# Altium project EPS.PrjPcb
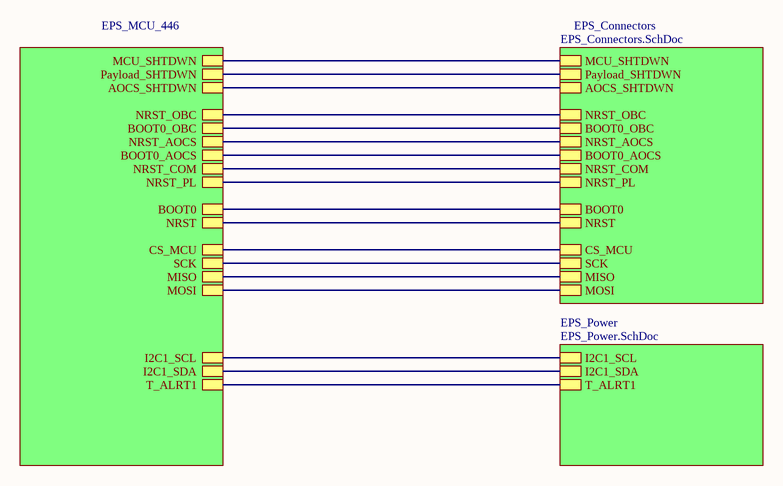
[diagram p0: EPS_Top.SchDoc]
4 sheets, 103 parts. Net scope: hierarchical (ports join the sheet entries above them; power ports are global).
Board file: PCB2EPS.PcbDoc
Sheets:
  EPS_Top.SchDoc
    EPS_Power = EPS_Power.SchDoc
    EPS_Connectors = EPS_Connectors.SchDoc
    EPS_MCU_446 = EPS_MCU.SchDoc

## Sheet EPS_Top.SchDoc
size A4; SheetNumber: 1; SheetTotal: 4

### Sub-sheets
EPS_Connectors = EPS_Connectors.SchDoc: NRST, BOOT0, CS_MCU, SCK, MISO, MOSI, BOOT0_OBC, NRST_OBC, NRST_AOCS, BOOT0_AOCS, NRST_COM, NRST_PL, MCU_SHTDWN, Payload_SHTDWN, AOCS_SHTDWN
EPS_MCU_446 = EPS_MCU.SchDoc: NRST, BOOT0, I2C1_SCL, I2C1_SDA, T_ALRT1, CS_MCU, SCK, MISO, MOSI, BOOT0_OBC, NRST_OBC, NRST_AOCS, BOOT0_AOCS, NRST_COM, NRST_PL, MCU_SHTDWN, Payload_SHTDWN, AOCS_SHTDWN
EPS_Power = EPS_Power.SchDoc: I2C1_SCL, I2C1_SDA, T_ALRT1

### Nets
ALERT: sheet EPS_Power/T_ALRT1, sheet EPS_MCU_446/T_ALRT1
AOCS_SHTDWN: sheet EPS_Connectors/AOCS_SHTDWN, sheet EPS_MCU_446/AOCS_SHTDWN
BOOT0: sheet EPS_Connectors/BOOT0, sheet EPS_MCU_446/BOOT0
BOOT0_AOCS: sheet EPS_Connectors/BOOT0_AOCS, sheet EPS_MCU_446/BOOT0_AOCS
BOOT0_OBC: sheet EPS_Connectors/BOOT0_OBC, sheet EPS_MCU_446/BOOT0_OBC
CS_MCU: sheet EPS_Connectors/CS_MCU, sheet EPS_MCU_446/CS_MCU
MCU_SHTDWN: sheet EPS_Connectors/MCU_SHTDWN, sheet EPS_MCU_446/MCU_SHTDWN
MISO: sheet EPS_Connectors/MISO, sheet EPS_MCU_446/MISO
MOSI: sheet EPS_Connectors/MOSI, sheet EPS_MCU_446/MOSI
NRST: sheet EPS_Connectors/NRST, sheet EPS_MCU_446/NRST
NRST_AOCS: sheet EPS_Connectors/NRST_AOCS, sheet EPS_MCU_446/NRST_AOCS
NRST_COM: sheet EPS_Connectors/NRST_COM, sheet EPS_MCU_446/NRST_COM
NRST_OBC: sheet EPS_Connectors/NRST_OBC, sheet EPS_MCU_446/NRST_OBC
NRST_PL: sheet EPS_Connectors/NRST_PL, sheet EPS_MCU_446/NRST_PL
Payload_SHTDWN: sheet EPS_Connectors/Payload_SHTDWN, sheet EPS_MCU_446/Payload_SHTDWN
SCK: sheet EPS_Connectors/SCK, sheet EPS_MCU_446/SCK
SCL: sheet EPS_Power/I2C1_SCL, sheet EPS_MCU_446/I2C1_SCL
SDA: sheet EPS_Power/I2C1_SDA, sheet EPS_MCU_446/I2C1_SDA

## Sheet EPS_Power.SchDoc
size A4; SheetNumber: 3; SheetTotal: 4
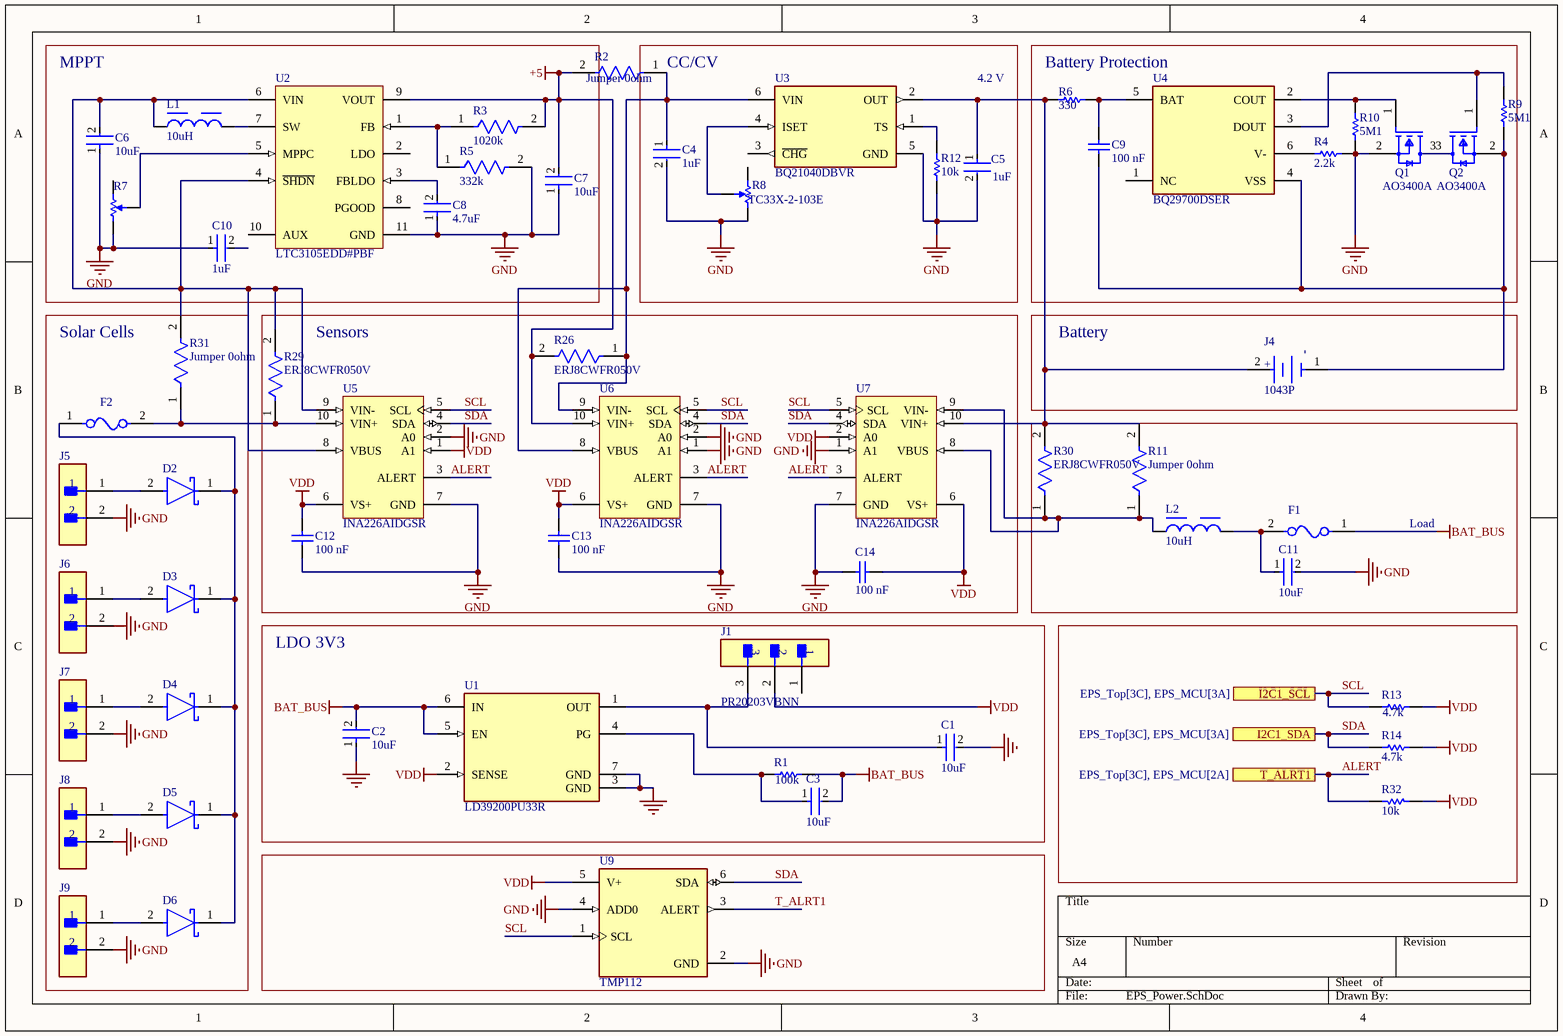
[diagram p1: EPS_Power.SchDoc]

### Parts
C1  10uF  [FP-CL21B106KOQNNNG-MFG]
C2  10uF  [FP-CL21B106KOQNNNG-MFG]
C3  10uF  [FP-CL21B106KOQNNNG-MFG]
C4  1uF  [FP-CL10-IPC_C]
C5  1uF  [FP-CL10-IPC_C]
C6  10uF  [FP-CL21B106KOQNNNG-MFG]
C7  10uF  [FP-CL21B106KOQNNNG-MFG]
C8  4.7uF  [FP-CC0805-0_85-MFG]
C9  100 nF  [CAPC1050X55X23ML05T13]
C10  1uF  [FP-CL10-IPC_A]
C11  10uF  [FP-CL21B106KOQNNNG-MFG]
C12  100 nF  [CAPC1050X55X23ML05T13]
C13  100 nF  [CAPC1050X55X23ML05T13]
C14  100 nF  [CAPC1050X55X23ML05T13]
D2  BAT60AE6327HTSA1  [FP-PG-SOD323-2-IPC_C]  (value not drawn)
D3  BAT60AE6327HTSA1  [FP-PG-SOD323-2-IPC_C]  (value not drawn)
D4  BAT60AE6327HTSA1  [FP-PG-SOD323-2-IPC_C]  (value not drawn)
D5  BAT60AE6327HTSA1  [FP-PG-SOD323-2-IPC_C]  (value not drawn)
D6  BAT60AE6327HTSA1  [FP-PG-SOD323-2-IPC_C]  (value not drawn)
F1  MF-NSMF020-2  [FP-MF-NSMF020-2-MFG]  (value not drawn)
F2  MF-NSMF020-2  [FP-MF-NSMF020-2-MFG]  (value not drawn)
J1  PR20203VBNN  [FP-PR20203VBNN-MFG]
J4  1043P  [FP-1043P-MFG]
J5  B2B-XH-A(LF)(SN)  [FP-B2B-XH-A_LF_SN-MFG]  (value not drawn)
J6  B2B-XH-A(LF)(SN)  [FP-B2B-XH-A_LF_SN-MFG]  (value not drawn)
J7  B2B-XH-A(LF)(SN)  [FP-B2B-XH-A_LF_SN-MFG]  (value not drawn)
J8  B2B-XH-A(LF)(SN)  [FP-B2B-XH-A_LF_SN-MFG]  (value not drawn)
J9  B2B-XH-A(LF)(SN)  [FP-B2B-XH-A_LF_SN-MFG]  (value not drawn)
L1  10uH  [WE-LHMI_4020]
L2  10uH  [WE-LHMI_4020]
Q1  AO3400A  [FP-SOT23-MFG]
Q2  AO3400A  [FP-SOT23-MFG]
R1  100k  [RESC1005X40X25NL05T10]
R2  Jumper 0ohm  [FP-RC1206-MFG]
R3  1020k  [FP-CRCW0603-e3-IPC_A]
R4  2.2k  [RESC1608X55X25LL10T15]
R5  332k  [FP-CRCW0603-e3-IPC_A]
R6  330  [RESC1608X55X30LL15T15]
R7  TC33X-2-103E  [BOUR-TC33X-2_V]  (value not drawn)
R8  TC33X-2-103E  [BOUR-TC33X-2_V]
R9  5M1  [RESC1609X50X30NL10T20]
R10  5M1  [RESC1609X50X30NL10T20]
R11  Jumper 0ohm  [FP-RC1206-MFG]
R12  10k  [RESC1005X40X25LL05T10]
R13  4.7k  [RESC1005X40X25LL05T05]
R14  4.7k  [RESC1005X40X25LL05T05]
R26  ERJ8CWFR050V  [FP-ERJ8CW-IPC_B]
R29  ERJ8CWFR050V  [FP-ERJ8CW-IPC_B]
R30  ERJ8CWFR050V  [FP-ERJ8CW-IPC_B]
R31  Jumper 0ohm  [FP-RC1206-MFG]
R32  10k  [RESC1005X40X25LL05T05]
U1  LD39200PU33R  [FP-DFN6-7946637-MFG]
U2  LTC3105EDD#PBF  [LT-DD-10_V]
U3  BQ21040DBVR  [FP-DBV0006A-MFG]
U4  BQ29700DSER  [FP-DSE0006A-IPC_B]
U5  INA226AIDGSR  [DGS0010A_L]
U6  INA226AIDGSR  [DGS0010A_L]
U7  INA226AIDGSR  [DGS0010A_L]
U9  TMP112  [FP-DRL0006A-MFG]

### Blocks framed on the sheet
MPPT: C6-C8 C10 L1 R3 R5 R7 U2
CC/CV: C4 C5 R8 R12 U3
Battery Protection: C9 Q1 Q2 R4 R6 R9 R10 U4
Solar Cells: D2-D6 F2 J5-J9 R31
Sensors: C12-C14 R26 R29 U5-U7
Battery: J4
Load: C11 F1 L2 R11 R30
LDO 3V3: C1-C3 J1 R1 U1

### Ports
I2C1_SCL (see EPS_Top[3C], EPS_MCU[3A]), I2C1_SDA (see EPS_Top[3C], EPS_MCU[3A]), T_ALRT1 (see EPS_Top[3C], EPS_MCU[2A])

### Nets
+5: C7.2 R2.2 R3.2 R26.2 U2.9(VOUT) U6.10(VIN+)
BAT_BUS: C2.2 C3.2 F1.1 R1.2 U1.5(EN) U1.6(IN)
GND: C1.2 C2.1 C4.2 C5.2 C6.1 C7.1 C8.1 C10.1 C11.2 C12.1 C13.1 C14.1 J5.2 J6.2 J7.2 J8.2 J9.2 Q1.2(S) R4.2 R5.2 R7.1 R8.3 R10.1 R12.2 U1.3(GND) U1.7(GND) U2.11(GND) U3.5(GND) U5.2(A0) U5.7(GND) U6.1(A1) U6.2(A0) U6.7(GND) U7.1(A1) U7.7(GND) U9.2(GND) U9.4(ADD0)
VDD: C12.2 C13.2 C14.2 J1.2 R13.2 R14.2 R32.1 U1.2(SENSE) U5.1(A1) U5.6(VS+) U6.6(VS+) U7.2(A0) U7.6(VS+) U9.5(V+)
ALERT: R32.2 U5.3(ALERT) U6.3(ALERT) U7.3(ALERT) ; port T_ALRT1
SCL: R13.1 U5.5(SCL) U6.5(SCL) U7.5(SCL) U9.1(SCL) ; port I2C1_SCL
SDA: R14.1 U5.4(SDA) U6.4(SDA) U7.4(SDA) U9.6(SDA) ; port I2C1_SDA
T_ALRT1: U9.3(ALERT)
NetC1_1: C1.1 J1.3 U1.1(OUT)
NetC3_1: C3.1 R1.1 U1.4(PG)
NetC4_1: C4.1 R2.1 R26.1 U3.6(VIN) U6.8(VBUS) U6.9(VIN-)
NetC5_1: C5.1 J4.2(A) R6.2 R11.2 R30.2 U3.2(OUT) U7.10(VIN+)
NetC6_2: C6.2 L1.1 R29.2 R31.2 U2.4(~{SHDN}) U2.6(VIN) U5.8(VBUS) U5.9(VIN-)
NetC8_2: C8.2 U2.3(FBLDO)
NetC9_1: C9.1 R6.1 U4.5(BAT)
NetC9_2: C9.2 J4.1(C) Q2.2(S) R9.1 U4.4(VSS)
NetC11_1: C11.1 F1.2 L2.2
NetD2_1: D2.1(C) D3.1(C) D4.1(C) D5.1(C) D6.1(C) F2.1
NetD2_2: D2.2(A) J5.1
NetD3_2: D3.2(A) J6.1
NetD4_2: D4.2(A) J7.1
NetD5_2: D5.2(A) J8.1
NetD6_2: D6.2(A) J9.1
NetF2_2: F2.2 R29.1 R31.1 U5.10(VIN+)
NetL1_2: L1.2 U2.7(SW)
NetL2_1: L2.1 R11.1 R30.1 U7.8(VBUS) U7.9(VIN-)
NetQ1_1: Q1.1(G) R10.2 U4.2(COUT)
NetQ1_3: Q1.3(D) Q2.3(D)
NetQ2_1: Q2.1(G) R9.2 U4.3(DOUT)
NetR3_1: R3.1 R5.1 U2.1(FB)
NetR4_1: R4.1 U4.6(V-)
NetR7_2: R7.2 U2.5(MPPC)
NetR8_2: R8.2 U3.4(ISET)
NetR12_1: R12.1 U3.1(TS)

Not connected (* = marked no-connect by the designer): C10 2; J1 1; R7 3; R8 1; U2 2(LDO) 8(PGOOD) 10(AUX); U3 3(~{CHG}); U4 1(NC)

### Notes on the sheet
- 4.2 V
- (near J1) +3V3
- (in symbol CMP-19636-000034-1) +

### Library data of the parts
C1-C3 C6 C7 C11 = CMP-13271-000015-1: CAP CER 10UF 16V X7R 0805; Manufacturer Part Number: CL21B106KOQNNNG; Manufacturer: Samsung Electro-Mechanics; Temperature Coefficient: 15%; Tolerance: 10%; Material: Ceramic; ComponentLink2URL: http://product.samsungsem.com/mlcc/CL21B106KOQNNN.do; Package: 0; Voltage Rating: 16V; Value: 10uF; Height: 1.4mm; Temperature Characteristic: X7R; Category: Cap; Lead Free: Yes; RoHS: TRUE; ComponentLink2Description: Datasheet; Octopart: https://octopart.com/cl21b106koqnnng-samsung-19995691; Device Class L1: Passive Components; Temperature Range Low: -55°C; Device Class L3: Ceramic Capacitors; Ipc Land Pattern Name: CAPC200125X125; Digikey Description: CAP CER 10UF 16V X7R 0805; Automotive: No; Capacitance: 10uF; Temperature Range High: +125°C; Device Class L2: Capacitors; Temperature: -55°C to +125°C
C4 C5 = CMP-13271-004127-1: Cap Ceramic 1uF 25V X5R ±10% Pad SMD 0603 +85°C T/R; Height: 0.8mm; Capacitance: 1uF; Depth: 0.8mm; Package Quantity: 1; Mount: Surface Mount; Contact Plating: Tin; Voltage Rating: 25V; Dielectric: X5R; Packaging: Tape and Reel; Material: Ceramic; Case Code (Metric): 1608; Length: 1.6mm; Voltage: 25V; Min Operating Temperature: -55°C; Width: 0.031inch; Tolerance: 10%; Case/Package: 0603; Radiation Hardening: No; Case Code (Imperial): 0603; Thickness: 0.035inch; Lead Free: Lead Free; Max Operating Temperature: 85°C; Voltage Rating (DC): 25V
C8 = CMP-03422-000207-1: CAP CER 4.7UF 16V X7R 0805; Manufacturer: Yageo; Manufacturer Part Number: CC0805KKX7R7BB475; Tolerance: 0.1; Material: Ceramic; Footprint Url: http://www.yageo.com/exep/pages/download/literatures/UPY-C_GEN_24.pdf; Device Class L3: Ceramic Capacitors; Temperature: -30°C to +85°C; Device Class L2: Capacitors; Automotive: No; Digikey Description: CAP CER 4.7UF 16V X7R 0805; Temperature Range High: +85°C; Lead Free: Yes; Mouser Description: Multilayer Ceramic Capacitors MLCC - SMD/SMT 4.7M pF 10% 16 Volts; Temperature Characteristic: X7R; Height: 0.95mm; Device Class L1: Passive Components; ComponentLink2Description: Datasheet; Category: Cap; Octopart: https://octopart.com/cc0805kkx7r7bb475-yageo-34429188; Temperature Range Low: -30°C; Package: CC0805-0.85; Ipc Land Pattern Name: CAPC200125X85; RoHS: TRUE; Value: 4.7 uF; Capacitance: 4.7 uF; ComponentLink2URL: http://www.yageo.com/documents/recent/UPY-GPHC_Y5V_6.3V-to-50V_8.pdf; Voltage Rating: 16 V
C9 C12-C14 = CMP-2000-05439-1: Chip Capacitor, 100 nF, +/- 10%, 16 V, -55 to 125 degC, 0402 (1005 Metric), RoHS, Tape and Reel; Manufacturer: Samsung Electro-Mechanics; Capacitance: 100000pF; Dielectric: X7R; Rated Voltage: 16V; Case Size/Dimension: 0402; Tolerance (%): ±10%; Manufacturer URL: http://www.samsungsem.com/global/index.jsp; Datasheet URL: https://datasheet.ciiva.com/29198/458718-da-01-en-vs-kondensator-0402-29198423.pdf; Datasheet Version: Nov-10
C10 = CMP-13271-001457-1: Cap Ceramic 1uF 16V X5R ±10% Pad SMD 0603 +85°C T/R; Dielectric: X5R; Height: 0.8mm; Capacitance: 1uF; Mount: Surface Mount; Thickness: 0.035inch; Width: 0.031inch; Min Operating Temperature: -55°C; Contact Plating: Tin; Case Code (Imperial): 0603; Depth: 0.8mm; Length: 1.6mm; Max Operating Temperature: 85°C; Packaging: Tape and Reel; Tolerance: 10%; Radiation Hardening: No; Case/Package: 0603; Package Quantity: 1; Voltage Rating: 16V; Case Code (Metric): 1608; Voltage: 16V; Material: Ceramic; Lead Free: Lead Free; Voltage Rating (DC): 16V
D2-D6 = CMP-32890-000004-1: DIODE SCHOTTKY 10V 3A SOD323-2; Forward Voltage: 370mV; Polarity: Standard; Peak Non-Repetitive Surge Current: 5A; Element Configuration: Single; Max Operating Temperature: 85°C; Current Rating: 3A; Number of Pins: 2; Mount: Surface Mount; Forward Current: 3A; Max Reverse Voltage (DC): 10V; Output Current: 3A; Contact Plating: Tin; Average Rectified Current: 3A; Lead Free: Lead Free; Max Repetitive Reverse Voltage (Vrrm): 10V; Voltage Rating (DC): 10V; Radiation Hardening: No; Halogen Free: Not Halogen Free; Case/Package: SOD-323-2; REACH SVHC: No SVHC; Min Operating Temperature: -55°C; Packaging: Tape and Reel
F1 F2 = CMP-07400-000029-1: PTC RESET FUSE 24V 200MA 1206; Manufacturer: Bourns; Trip Current: 0.46A; Trip Time: 0.6s; Hold Current: 0.2A; Current Rating: 10A; Resistance: 0.6-2.6Ω; Automotive Grade: Grade 3; Value: 0.6-2.6Ω; Voltage Rating: 24V; Ambient Temperature Range Low: -40°C; Device Class L1: Circuit Protection; Temperature Range Low: -40°C; Temperature: -40°C to +85°C; Category: Fuse; Temperature Range High: +85°C; Mouser Description: Resettable Fuses - PPTC 0.20A 24V 0.60ohm MAX (R); Device Class L3: unset; RoHS: TRUE; Package: MF-NSMF020-2; Ambient Temperature Range High: +85°C; ComponentLink2Description: Datasheet; Digikey Description: PTC RESET FUSE 24V 200MA 1206; Device Class L2: PTC Resettable Fuses; Manufacturer Part Number: MF-NSMF020-2; Octopart: https://octopart.com/mf-nsmf020-2-bourns-94649; Automotive: Yes; Height: 0.85mm; Lead Free: Yes; ComponentLink2URL: https://www.bourns.com/docs/Product-Datasheets/mfnsmf.pdf
J1 = CMP-77940-000002-1: CONN HEADER VERT 3POS 2.54MM; Manufacturer: Metz Connect; Conn Orientation: Straight; Current Rating: 3A; Number Of Contacts: 3; Conn Gender: Male; Temperature: -40°C to +105°C; Pitch: 2.54mm; Device Class L1: Connectors; Digikey Description: CONN HEADER VERT 3POS 2.54MM; ComponentLink2URL: https://datasheet.octopart.com/PR20203VBNN-Metz-Connect-datasheet-101610322.pdf; Height: 8.6mm; Temperature Range High: +105°C; Manufacturer Part Number: PR20203VBNN; Number Of Rows: 1; Octopart: https://octopart.com/pr20203vbnn-metz+connect-87667116; Device Class L3: unset; ComponentLink2Description: Datasheet; Device Class L2: Headers and Wire Housings; Temperature Range Low: -40°C; Automotive: No; Contact Material: Gold,Nickel; Category: Conn; Lead Free: Yes; RoHS: TRUE; Package: PR20203VBNN
J4 = CMP-19636-000034-1: BATT HOLDER 18650 1 CELL PC PIN; Number of Cells: 1; Series: -; Termination: PC Pin; Package Quantity: 50; Min Operating Temperature: -50°C; Mount: Through Hole; Packaging: Tray; Max Operating Temperature: 145°C
J5-J9 = CMP-2000-05888-3: CONN HEADER VERT 2POS 2.5MM; Current Rating: 3A; Voltage Rating: 250V; Number of Contacts: 2; Contact Resistance: 20mR; Wire/Cable Gauge: 22AWG; Insulation Resistance: 1GR; Connector Type: Male Pin; Packaging: Bulk; Contact Material: Brass; Lead Free: Lead Free; Orientation: Straight; Contact Plating: Tin; Max Current Rating: 3A; Termination: Solder; Fastening Type: Detent; Depth: 5.75mm; Housing Material: Polyamide; REACH SVHC: No SVHC; Series: XH; Voltage Rating (AC): 250V; Number of Positions: 2; Color: Natural; Contact Type: Male Pin; Max Voltage Rating (DC): 250V; Pitch: 2.5mm; Lead Pitch: 2.5mm; Mount: Through Hole; Max Operating Temperature: 85°C; Length: 7.4mm; Max Voltage Rating (AC): 250V; Min Operating Temperature: -25°C; Number of Rows: 1; Housing Color: White
L1 L2 = CMP-1353-00043-5: NexarPartId: 21272410; Inductance: 10µH; Tolerance: 20%; Max DC Current: 1.5A; Shielding: Shielded; Frequency: 23MHz; DC Resistance (DCR): 215mΩ; Test Frequency: 100kHz; Core Material: Composite, Ferrite; Series Resistance: 243mΩ; REACH SVHC: Unknown; Case/Package: Nonstandard; Width: 4.06mm; Packaging: Tape & Reel (TR); Height - Seated (Max): 2.0066mm; Ambient Temperature Range Low: -40°C; Length: 4.45mm; Mount: Surface Mount; Ambient Temperature Range High: 85°C; Inductance Tolerance: 20%; Composition: Wirewound; Min Operating Temperature: -40°C; Current Rating: 1.5A; Max Operating Temperature: 125°C; Depth: 4.06mm; Height: 1.8mm; Saturation Current: 1.5A; RMS Current (Irms): 1.5A; Termination: SMD/SMT; Number of Pins: 2; RoHS: Compliant; Self Resonant Frequency: 23MHz
Q1 Q2 = CMP-83955-000006-1: MOSFET N-CH 30V 5.7A SOT23; Input Capacitance: 630pF; Number of Elements: 1; Rds On Max: 26.5mR; Max Power Dissipation: 1.4W; Gate to Source Voltage (Vgs): 12V; Min Operating Temperature: -55°C; Lead Free: Lead Free; Number of Pins: 3; Drain to Source Voltage (Vdss): 30V; Case/Package: SOT-23; Mount: Surface Mount; Continuous Drain Current (ID): 5.7A; Radiation Hardening: No; Packaging: Tape and Reel; Max Operating Temperature: 150°C; Power Dissipation: 1.4W
R1 = CMP-2002-07343-1: Part Number: RC0402FR-07100KL; Manufacturer: Yageo / Phycomp
R2 R11 R31 = CMP-2100-03681-2: RES SMD 0 OHM JUMPER 1/4W 1206; Manufacturer Part Number: RC1206JR-070RL; Manufacturer: YAGEO; Voltage Rating: 200V; Temperature Coefficient: 300ppm/°C; Power Rating: 0.25W; Value: 0Ω; Tolerance: 5%; Temperature Range Low: -55°C; Category: Res; Automotive: No; Ipc Land Pattern Name: RESC310160X55; Device Class L1: Passive Components; Temperature: -55°C to +155°C; ComponentLink2URL: https://www.yageo.com/upload/media/product/productsearch/datasheet/rchip/PYu-RC_Group_51_RoHS_L_10.pdf; Lead Free: Yes; Height: 0.65mm; Footprint Url: https://www.yageo.com/upload/website/yageo_PYu-R_Mount_10_19050818_343.pdf; Package: RC1206; Digikey Description: RES SMD 0 OHM JUMPER 1/4W 1206; Temperature Range High: +155°C; Device Class L3: Chip SMD Resistors; Device Class L2: Resistors; Octopart: https://octopart.com/rc1206jr-070rl-yageo-40025601; Resistance: 0Ω; Series: RC; ComponentLink2Description: Datasheet; Composition: Thick Film; RoHS: TRUE; Mouser Description: Resistor: thick film; SMD; 1206; 0O; 0.25W; ±5%; -55÷155°C
R3 = CMP-2000-03018-2: RES Thick Film, 1.02MΩ, 1%, 0.1W, 100ppm/°C, 0603; Voltage Rating (DC): 75V; Power Rating: 100mW; Resistance: 1.02MR; Features: Automotive AEC-Q200; Depth: 0.85mm; Max Operating Temperature: 155°C; Tolerance: 1%; Package Quantity: 10; Length: 1.55mm; Mount: Surface Mount; Termination: SMD/SMT; Width: 0.033inch; Temperature Coefficient: 100ppm/°C; Min Operating Temperature: -55°C; Composition: Thick Film; Max Power Dissipation: 100mW; Case Code (Imperial): 0603; Case/Package: 0603; Voltage Rating: 75V; Contact Plating: Tin; Case Code (Metric): 1608; Weight: 7.1E-05oz; Lead Free: Lead Free; Height: 0.02inch; Military Standard: Not; Number of Terminations: 2; Radiation Hardening: No; Packaging: Tape and Reel
R4 = CMP-2000-06934-1: Thick Film Resistor, 2.2 KOhm, 100 mW, 50 V, +/- 1%, -55 to 155 degC, 2-Pin SMD (0603), RoHS, Tape and Reel; Manufacturer: Yageo; Resistance: 2.2kOhms; Temperature Coefficient: 100PPM/C; Voltage Rating: 50V; Power Rating: 100mW; Tolerance: 1%; Datasheet Version: Rev. 7, 05/2017; Case Code - mm: 1608; Series: RC; Mounting Technology: SurfaceMount; Package Description: 2-Pin Surface Mount Device, Body 1.6 x 0.8 mm; Case Code - in: 0603; Package Reference: 0603; Product: ThickFilmResistorsGeneralPurpose; Manufacturer URL: http://www.yageo.com/; Termination Style: SMD/SMT; Operating Temperature Range: -55Cto+155C; Datasheet URL: http://www.yageo.com/documents/recent/PYu-RC_Group_51_RoHS_L_7.pdf; Packaging: Reel
R5 = CMP-2000-03242-2: RES Thick Film, 332kΩ, 1%, 0.1W, 100ppm/°C, 0603; Voltage Rating: 75V; Resistance: 332kR; Max Power Dissipation: 100mW; Radiation Hardening: No; Max Operating Temperature: 155°C; Termination: SMD/SMT; Case Code (Imperial): 0603; Case/Package: 0603; Contact Plating: Tin; Case Code (Metric): 1608; Features: Automotive AEC-Q200; Number of Terminations: 2; Number of Pins: 2; Package Quantity: 10; Min Operating Temperature: -55°C; Temperature Coefficient: 100ppm/°C; Length: 1.55mm; Working Voltage: 75V; Packaging: Tape and Reel; Weight: 7.1E-05oz; Width: 0.85mm; Height: 0.45mm; Depth: 0.85mm; Tolerance: 1%; Power Rating: 100mW; Military Standard: Not; Composition: Thick Film; Lead Free: Lead Free; Voltage Rating (DC): 75V
R6 = CMP-2000-00435-2: Chip Resistor, 330 Ohm, +/- 1%, 0.1 W, -55 to 155 degC, 0603 (1608 Metric), RoHS, Tape and Reel; Gender: Male; Mating Cycles: 10000; Current Rating: 500 mA; Voltage Rating: 10 V; REACH SVHC: No SVHC; PackageDescription: 2-Pin Surface Mount Device, Body 1.6 x 0.85 mm; Contact Finish: Gold; Pins: 8; ComponentLink1Description: Manufacturer URL; Packaging: Tape and Reel; Max Operating Temperature: 85 degC; Contact Material: Copper; Height: 1.45 mm; Width: 1.45 mm; DatasheetVersion: Apr-15; Package Quantity: 1500; Contact Plating: Gold; PackageReference: 0603; Mount: Surface Mount; Lead Pitch: 1.1 mm; Min Operating Temperature: -25 degC; ComponentLink1URL: http://www.panasonic.com/; ComponentLink2URL: http://industrial.panasonic.com/cdbs/www-data/pdf/RDA0000/AOA0000C86.pdf; Length: 13.7 mm; ComponentLink2Description: Datasheet; RoHSCompliant: true
R7 R8 = CMP-2100-03695-1: Trimming Potentiometer, 10000 Ohm, -40 to 100 degC, 3-Pin SMD, RoHS, Tape and Reel; Manufacturer: Bourns; Tolerance: 25%; Max Power Dissipation: 100mW; Number of Turns: 1; Resistance: 10KOhm; Temperature Coefficient: 250ppm/degreesC; Voltage Rating (DC): 50V; Datasheet URL: http://www.bourns.com/docs/Product-Datasheets/TC33.pdf; Composition: Potentiometer; Package Description: 3-Pin Surface Mount Device, Body 3.8 x 3.6 mm; Weight: 29.4mg; Power Rating: 100mW; Termination: FootPrint; Manufacturer URL: http://www.bourns.com/; Width: 0.118inch; Height: 0.047inch; Military Standard: Not; Radiation Hardening: No; Colour: Silver; Case/Package: SMD/SMT; Depth: 3.8mm; Min Operating Temperature: -40degC; Lead Free: LeadFree; Datasheet Version: 42583.0; REACH SVHC: NoSVHC; Length: 3mm; RoHSCompliant: true; Contact Plating: Silver; Taper: Linear; Packaging: TapeandReel; Mount: SurfaceMount; Max Operating Temperature: 100degC; Package Reference: TC33X-2; Package Quantity: 2500
R9 R10 = CMP-2000-03491-1: Part Number: CRCW06035M10FKEA; Manufacturer: Vishay Dale
R12 = CMP-2002-07353-1: Part Number: RC0402FR-0710KL; Manufacturer: Yageo / Phycomp
R13 R14 = CMP-2002-01154-4: Chip Resistor, 4.7 KOhm, +/- 1%, 0.1 W, -55 to 155 degC, 0402 (1005 Metric), RoHS, Tape and Reel; PartNumber: ERJ-2RKF4701X; Voltage Rating: 50 V; Case\/Package: 0402; Power Rating: 100 mW; Height: 0.35 mm; Mounting Technology: Surface Mount; REACH SVHC: Yes; Resistance: 4.7 KOhm; Max Operating Temperature: 155 degC; ComponentLink1Description: Manufacturer URL; ComponentLink2Description: Datasheet; Pins: 2; PackageReference: 0402; Tolerance: 1%; Case Code (Imperial): 0402; Length: 1 mm; PackageDescription: 2-Pin Surface Mount Device, Body 1 x 0.5 mm; RoHSCompliant: true; Package Quantity: 1; Radiation Hardening: No; DatasheetVersion: 04/2015; Width: 0.5 mm; Case Code (Metric): 1005; Mount: Surface Mount; ComponentLink1URL: http://www.panasonic.com/; Min Operating Temperature: -55 degC; Packaging: Cut Tape; ComponentLink2URL: http://industrial.panasonic.com/cdbs/www-data/pdf/RDA0000/AOA0000C86.pdf
R26 R29 R30 = CMP-2003-00803-2: RES 0.05 OHM 1% 1W 1206; Temperature Coefficient: 75ppm/°C; Resistance: 50mR; Power Rating: 1W; Case Code (Metric): 3216; Features: Automotive AEC-Q200; Height: 0.03inch; RoHS Compliant: Yes; Mount: Surface Mount; Max Power Dissipation: 1W; Max Operating Temperature: 125°C; REACH SVHC: No SVHC; Number of Terminations: 2; Case Code (Imperial): 1206; Termination: SMD/SMT; Case/Package: 1206; Packaging: Cut Tape; Resistor Type: Thick Film; Width: 0.063inch; Depth: 1.6mm; Length: 0.126inch; Tolerance: 1%; Min Operating Temperature: -55°C
R32 = CMP-2000-07588-1: Chip Resistor, 10 KOhm, +/- 1%, 0.1 W, -55 to 155 degC, 0402 (1005 Metric), RoHS, Tape and Reel; Manufacturer: Panasonic; Power Rating: 100mW; Voltage Rating: 50V; Resistance: 10KOhm; Case\/Package: 0402; Temperature Coefficient: 100ppm\/degreesC; RoHSCompliant: True; Lead Free: LeadFree; Package Quantity: 1; Contact Plating: Tin; Length: 1mm; Radiation Hardening: No; REACH SVHC: NoSVHC; Max Operating Temperature: 155degC; Depth: 0.5mm; Case Code (Imperial): 0402; Military Standard: Not; Package Description: 2-Pin Surface Mount Device, Body 1 x 0.5 mm; Termination: SMD/SMT; Case Code (Metric): 1005; Height: 0.35mm; Packaging: TapeandReel; Voltage Rating (DC): 50V; Package Reference: 402; Number of Pins: 2; Tolerance: 1%; Mounting Technology: SurfaceMount; Width: 0.02inch; Mount: SurfaceMount; Datasheet URL: https://industrial.panasonic.com/cdbs/www-data/pdf/RDA0000/AOA0000C304.pdf; Composition: ThickFilm; Datasheet Version: 02/2017; Manufacturer URL: http://www.panasonic.com/; Max Power Dissipation: 100mW; Number of Terminations: 2; Min Operating Temperature: -55degC
U1 = CMP-12153-000011-1: IC REG LINEAR 3.3V 2A 6DFN; Number of Outputs: 1; Max Input Voltage: 6V; Output Type: Fixed; Min Input Voltage: 1.25V; Dropout Voltage: 130mV; Operating Supply Current: 1mA; Number of Regulators: 1; Case/Package: DFN; Packaging: Tape and Reel; Output Current: 2A; Min Operating Temperature: -40°C; Mount: Surface Mount; Output Voltage: 3.3V; Max Operating Temperature: 125°C; Lead Free: Lead Free; Package Quantity: 3000
U2 = CMP-0473-00051-1: 400 mA Step-Up DC/DC Converter with Maximum Power Point Control and 250 mV Start-Up, 10-pin SON (DD-10), -40 to 85 degC, Pb-Free; Manufacturer: Linear Technology; Vin Min(V): 0.225; Vin Max(V): 5; Energy Source: Solar; Number of Outputs: 1; Topology: Boost; Vout Max(V): 5.25; ComponentLink2Description: Datasheet; ComponentLink3Description: Package Specification; Mounting Technology: Surface Mount; ComponentLink1URL: http://www.linear.com/; PackageVersion: Rev. C, 06/2010; RoHS: TRUE; ComponentLink1Description: Manufacturer URL; PackageReference: DD-10; ComponentLink2URL: http://cds.linear.com/docs/en/datasheet/3105fa.pdf; PartNumber: LTC3105EDD#PBF; PackageDescription: 10-Pin Plastic DFN, Body 3 x 3 mm, Pitch 0.5 mm; ComponentLink3URL: http://cds.linear.com/docs/en/packaging/DFN_10_05-08-1699.pdf; DatasheetVersion: Rev. A; Code_JEDEC: MO-229
U3 = CMP-04911-000045-1: IC BATT CHG LI-ION 1CELL SOT23-6; Differential Output: No; Settling Time: 30us; Fault Protection: Over Voltage; Number of Bits: 16; Output Type: Analog Current/Voltage; Interface: USB; Number of Cells: 1; Max Supply Voltage: 6.45V; Battery Pack Voltage: 4.2V; Max Charge Current: 800mA; Number of D/A Converters: 4; Mount: Surface Mount; Case/Package: SOT-23-6; RoHS Compliant: Yes; Packaging: Cut Tape; Min Operating Temperature: 0°C; Lead Free: Lead Free; Max Operating Temperature: 125°C
U4 = CMP-04911-000043-1: IC LITHIUM BATT PROTECT 6-SON; Number of Cells: 1; Fault Protection: Over Current; Operating Supply Voltage: 8V; Packaging: Tape and Reel; RoHS Compliant: Yes; Contact Plating: Gold; Lead Free: Lead Free; Min Operating Temperature: -40°C; Number of Pins: 6; Max Operating Temperature: 85°C; Package Quantity: 3000; Mount: Surface Mount; Weight: 0.000342oz; Supplier: Future Electronics; Supplier Part Number: 4023214
U5-U7 = CMP-0704-00058-2: High-Side Measurement, Bi-Directional Current / Power Monitor with I2C Interface, 2.7 to 5.5 V, -40 to 125 degC, 10-pin SOP (DGS10), Green (RoHS & no Sb/Br); Vs(Max)(V): 5.5; CMRR(Min)(dB): 126; Rating: Catalog; Input Offset (+/-)(Max)(uV): 10; Small-Signal Bandwidth(Typ)(MHz): 0.007; Input Offset Drift (+/-)(Max)(uV/Degrees Celsius): 0.1; Common Mode Range(Max)(V): 36; Gain(V/V): 1; SubFamily: Current Shunt Monitor; Quiescent Current (+/-)(Typ)(mA): 0.33; Vs(Min)(V): 2.7; Common Mode Range(Min)(V): 0; ComponentLink2URL: http://www.ti.com/general/docs/lit/getliterature.tsp?genericPartNumber=INA226&fileType=pdf; ComponentLink1URL: http://www.ti.com/; PartNumber: INA226AIDGSR; Mounting Technology: Surface Mount; PackageDescription: 10-Pin Plastic Small Outline, Body 3 x 3 mm, Pitch 0.5 mm; ComponentLink3Description: Package Specification; Code_JEDEC: MO-153; Eco-Plan: Green (RoHS & no Sb/Br); PackageReference: DGS0010A; ComponentLink2Description: Datasheet; ComponentLink3URL: http://www.ti.com/lit/ml/mpds035b/mpds035b.pdf; ComponentLink1Description: Manufacturer URL; DatasheetVersion: SBOS547; PackageVersion: 4073272/C, 02/2004
U9 = CMP-04948-000024-1: SENSOR DIGITAL -40C-125C 6SOT / TMP112AIDRLR, NOT AQDRLRQ1; Manufacturer: Texas Instruments; Manufacturer Part Number: TMP112AQDRLRQ1; Resolution: 12bits; Automotive Grade: Grade 1; Standoff Height: 0mm; Max Junction Temp: +150°C; Max Supply Voltage: 3.6V; Min Supply Voltage: 1.4V; Output Voltage: 5V; Interface: I2C,2-Wire,SMBus; Sensor Output: I2C,SMBus; Operating Supply Current: 7-85uA; Temperature Range Low: -40°C; Device Class L2: Temperature and Humidity Sensors; Height: 0.6mm; Automotive: Yes; Temperature Range High: +125°C; Category: IC; RoHS: TRUE; Lead Free: Yes; Ambient Temperature Range High: +125°C; Ambient Temperature Range Low: -40°C; Octopart: https://octopart.com/tmp112aqdrlrq1-texas+instruments-50418097; Ipc Land Pattern Name: SOTFL50P160X60-6; Device Class L1: Sensors; Device Class L3: unset; Digikey Description: SENSOR DIGITAL -40C-125C 6SOT; Mouser Description: Temp Sensor Digital Serial (2-Wire, I2C) Automotive 6-Pin SOT-563 T/R; Temperature: -40°C to +125°C; ComponentLink2Description: Datasheet; ComponentLink2URL: http://www.ti.com/lit/ds/symlink/tmp112-q1.pdf; Package: DRL0006A

## Sheet EPS_Connectors.SchDoc
size A4; SheetNumber: 4; SheetTotal: 4
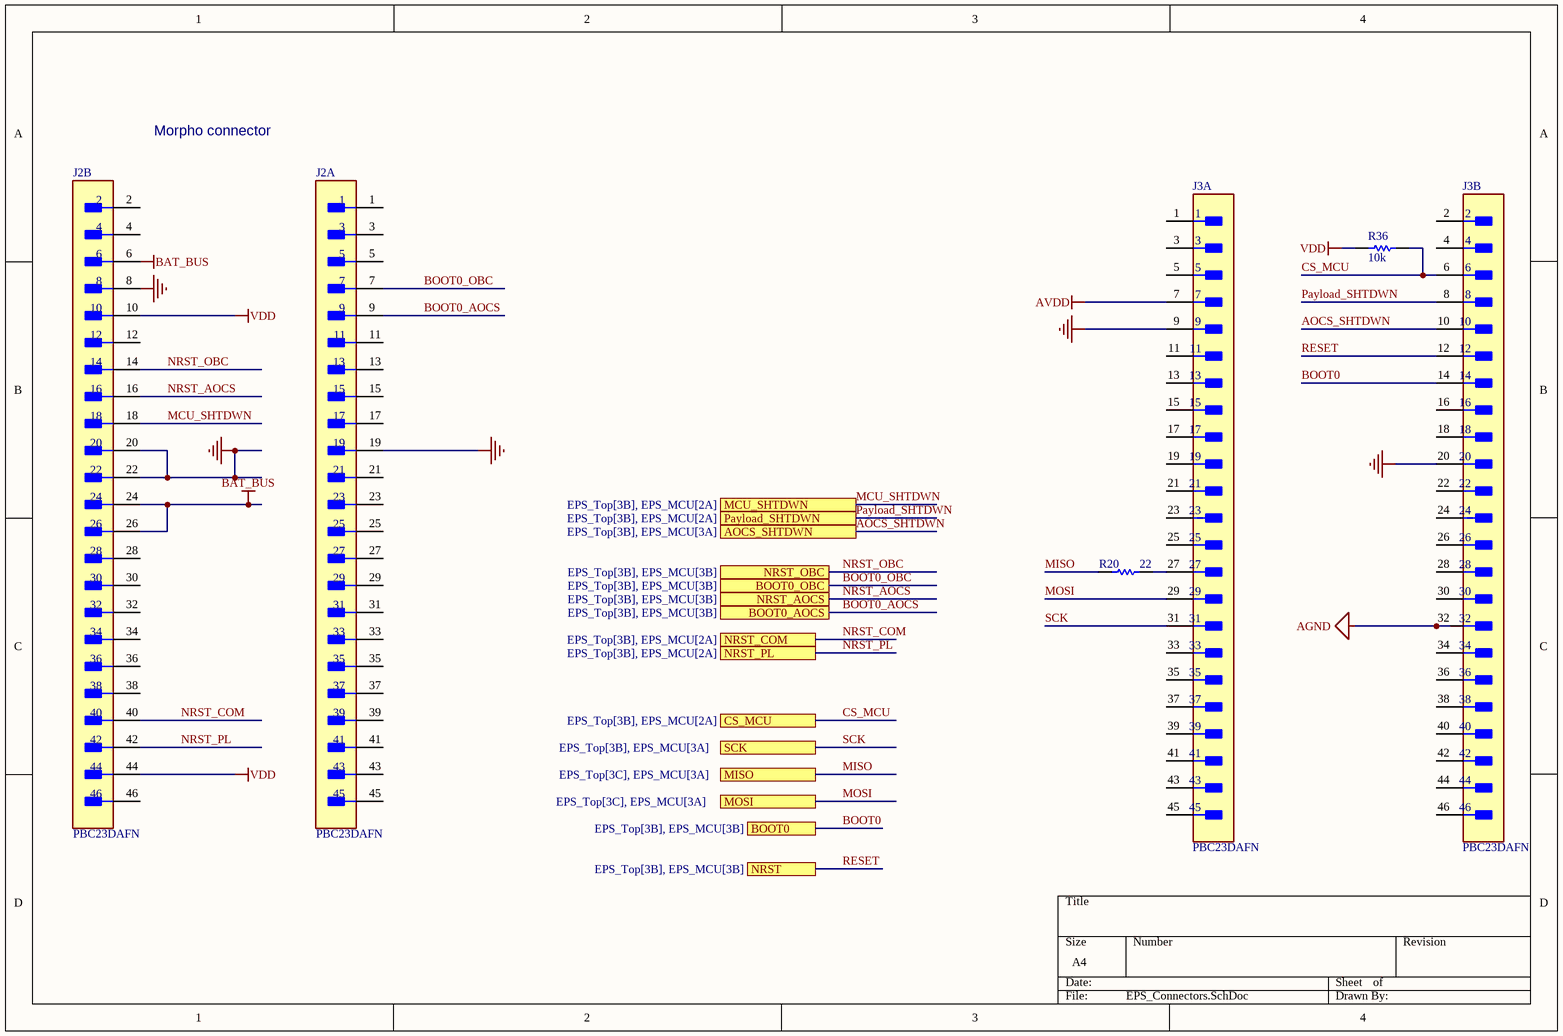
[diagram p2: EPS_Connectors.SchDoc]

### Parts
J2  PBC23DAFN  [FP-PBC23DAFN-MFG]  (parts A,B of 2)
J3  PBC23DAFN  [FP-PBC23DAFN-MFG]  (parts A,B of 2)
R20  22  [RESC1608X55X25NL10T15]
R36  10k  [RESC1005X40X25LL05T05]

### Ports
AOCS_SHTDWN (see EPS_Top[3B], EPS_MCU[3A]), BOOT0 (see EPS_Top[3B], EPS_MCU[3B]), BOOT0_AOCS (see EPS_Top[3B], EPS_MCU[3B]), BOOT0_OBC (see EPS_Top[3B], EPS_MCU[3B]), CS_MCU (see EPS_Top[3B], EPS_MCU[2A]), MCU_SHTDWN (see EPS_Top[3B], EPS_MCU[2A]), MISO (see EPS_Top[3C], EPS_MCU[3A]), MOSI (see EPS_Top[3C], EPS_MCU[3A]), NRST (see EPS_Top[3B], EPS_MCU[3B]), NRST_AOCS (see EPS_Top[3B], EPS_MCU[3B]), NRST_COM (see EPS_Top[3B], EPS_MCU[2A]), NRST_OBC (see EPS_Top[3B], EPS_MCU[3B]), NRST_PL (see EPS_Top[3B], EPS_MCU[2A]), Payload_SHTDWN (see EPS_Top[3B], EPS_MCU[2A]), SCK (see EPS_Top[3B], EPS_MCU[3A])

### Nets
AGND: J3.32
AVDD: J3.7
BAT_BUS: J2.6 J2.24 J2.26
GND: J2.8 J2.19 J2.20 J2.22 J3.9 J3.20
VDD: J2.10 J2.44 R36.2
AOCS_SHTDWN: J3.10 ; port AOCS_SHTDWN
BOOT0: J3.14 ; port BOOT0
BOOT0_AOCS: J2.9 ; port BOOT0_AOCS
BOOT0_OBC: J2.7 ; port BOOT0_OBC
CS_MCU: J3.6 R36.1 ; port CS_MCU
MCU_SHTDWN: J2.18 ; port MCU_SHTDWN
MISO: R20.1 ; port MISO
MOSI: J3.29 ; port MOSI
NRST_AOCS: J2.16 ; port NRST_AOCS
NRST_COM: J2.40 ; port NRST_COM
NRST_OBC: J2.14 ; port NRST_OBC
NRST_PL: J2.42 ; port NRST_PL
Payload_SHTDWN: J3.8 ; port Payload_SHTDWN
RESET: J3.12 ; port NRST  [project net NRST]
SCK: J3.31 ; port SCK
NetJ3_27: J3.27 R20.2

Not connected (* = marked no-connect by the designer): J2 1 2 3 4 5 11 12 13 15 17 21 23 25 27 28 29 30 31 32 33 34 35 36 37 38 39 41 43 45 46; J3 1 2 3 4 5 11 13 15 16 17 18 19 21 22 23 24 25 26 28 30 33 34 35 36 37 38 39 40 41 42 43 44 45 46

### Notes on the sheet
- Morpho connector

### Library data of the parts
J2 J3 = CMP-25680-000057-1: CONN HEADER VERT 46POS 2.54MM; Connector Type: Male Pin; Gender: Male; Number of Contacts: 46; Pitch: 0.1inch; Mount: Through Hole; Height: 2.54mm; Housing Material: Plastic; Contact Plating: Gold; Length: 58.4mm; RoHS Compliant: Yes; Packaging: Bulk; Termination: Solder; Number of Rows: 2; Series: -; Lead Free: Lead Free; Row Spacing: 0.1inch; Contact Type: Male Pin; Contact Material: Bronze; Color: Black; Number of Positions: 46; Width: 5.08mm; Contact Mating Length: 0.23inch; Package Quantity: 1; Housing Color: Black
R20 = CMP-1659-00033-1: Chip Resistor, 22 Ohm, +/- 1%, 0.1 W, -55 to 155 degC, 0603 (1608 Metric), RoHS, Tape and Reel; Max Ouput Current: 8 A; Case\Package: SIP; Max Input Voltage: 1.4 V; ComponentLink2URL: http://www.yageo.com/documents/recent/PYu-RC_Group_51_RoHS_L_04.pdf; RoHSCompliant: true; Max Operating Temperature: 100 degC; PackageDescription: 2-Pin Surface Mount Device, Body 1.6 x 0.8 mm; ComponentLink1Description: Manufacturer URL; ComponentLink1URL: http://www.yageo.com/; Length: 18.5 mm; REACH SVHC: Unknown; Pins: 4; DatasheetVersion: Rev. 4, 02/2016; PackageReference: 0603; Output Current: 8 A; Min Operating Temperature: -25 degC; Height: 19.6 mm; Mount: Through Hole; Radiation Hardening: No; ComponentLink2Description: Datasheet; Package Quantity: 200; Packaging: Rail/Tube
R36 = CMP-2000-07588-1: as R32 on sheet EPS_Power; RoHSCompliant: True; Lead Free: LeadFree; Package Quantity: 1; Contact Plating: Tin; Length: 1mm; Radiation Hardening: No; REACH SVHC: NoSVHC; Max Operating Temperature: 155degC; Depth: 0.5mm; Case Code (Imperial): 0402; Military Standard: Not; Package Description: 2-Pin Surface Mount Device, Body 1 x 0.5 mm; Termination: SMD/SMT; Case Code (Metric): 1005; Height: 0.35mm; Packaging: TapeandReel; Voltage Rating (DC): 50V; Package Reference: 402; Number of Pins: 2; Tolerance: 1%; Mounting Technology: SurfaceMount; Width: 0.02inch; Mount: SurfaceMount; Datasheet URL: https://industrial.panasonic.com/cdbs/www-data/pdf/RDA0000/AOA0000C304.pdf; Composition: ThickFilm; Datasheet Version: 02/2017; Manufacturer URL: http://www.panasonic.com/; Max Power Dissipation: 100mW; Number of Terminations: 2; Min Operating Temperature: -55degC

## Sheet EPS_MCU.SchDoc
size A4; SheetNumber: 2; SheetTotal: 4
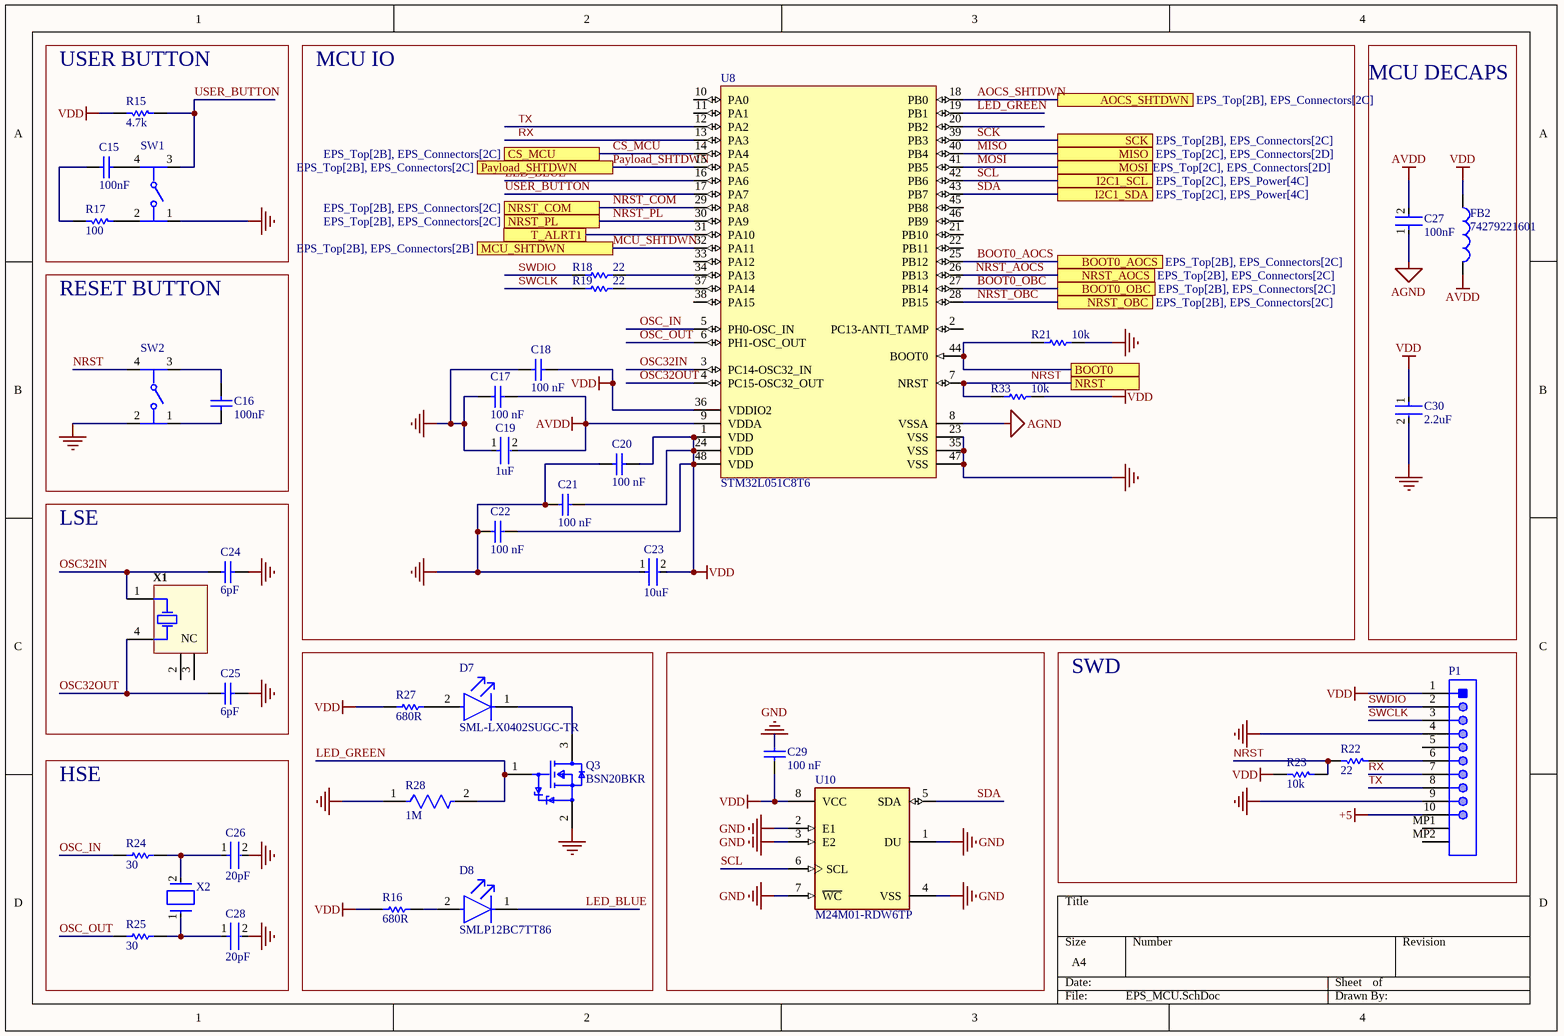
[diagram p3: EPS_MCU.SchDoc]

### Parts
C15  100nF  [CAPC1050X55X23ML05T13]
C16  100nF  [CAPC1050X55X23ML05T13]
C17  100 nF  [CAPC1050X55X23ML05T13]
C18  100 nF  [CAPC1050X55X23ML05T13]
C19  1uF  [FP-CL10-IPC_A]
C20  100 nF  [CAPC1050X55X23ML05T13]
C21  100 nF  [CAPC1050X55X23ML05T13]
C22  100 nF  [CAPC1050X55X23ML05T13]
C23  10uF  [FP-CL21B106KOQNNNG-MFG]
C24  6pF  [CAPC1005X55X25ML05T10]
C25  6pF  [CAPC1005X55X25ML05T10]
C26  20pF  [FP-GCM155-0_05-IPC_C]
C27  100nF  [FP-CC0402-MFG]
C28  20pF  [FP-GCM155-0_05-IPC_C]
C29  100 nF  [CAPC1050X55X23ML05T13]
C30  2.2uF  [FP-CL10-IPC_A]
D7  SML-LX0402SUGC-TR  [FP-SML-LX0402SUGC-TR-MFG]
D8  SMLP12BC7TT86  [FP-SML-P12-MFG]
FB2  74279221601  [WE-MPSB_1206_L3.2W1.6H1.1]
P1  SM10B-SHLS-TF(LF)(SN)  [JST-SM10B-SHLS-TF_V]  (value not drawn)
Q3  BSN20BKR  [FP-SOT23-IPC_C]
R15  4.7k  [RESC1005X40X25LL05T05]
R16  680R  [RESC1005X40X25ML05T05]
R17  100  [RESC1608X55X30LL15T15]
R18  22  [RESC1608X55X25NL10T15]
R19  22  [RESC1608X55X25NL10T15]
R21  10k  [RESC1005X40X25LL05T10]
R22  22  [RESC1608X55X25NL10T15]
R23  10k  [RESC1005X40X25LL05T10]
R24  30  [RESC1609X50X30NL10T20]
R25  30  [RESC1609X50X30NL10T20]
R27  680R  [RESC1005X40X25ML05T05]
R28  1M  [FP-MCR01-IPC_B]
R33  10k  [RESC1005X40X25LL05T10]
SW1  PTS810SJM250SMTRLFS  [FP-PTS810SJM250SMTRLFS-MFG]  (value not drawn)
SW2  PTS810SJM250SMTRLFS  [FP-PTS810SJM250SMTRLFS-MFG]  (value not drawn)
U8  STM32L051C8T6  [STM-LQFP48_L]
U10  M24M01-RDW6TP  [FP-TSSOP8-TSSOP8AM-IPC_A]
X1  ABS25-32.768KHZ-6-T  [ABRA-ABS25-4_V]  (value not drawn)
X2  ABM3-8.000MHZ-D2Y-T  [FP-ABM3-MFG]  (value not drawn)

### Blocks framed on the sheet
USER BUTTON: C15 R15 R17 SW1
MCU IO: C17-C23 R18 R19 R21 R33 U8
MCU DECAPS: C27 C30 FB2
RESET BUTTON: C16 SW2
LSE: C24 C25 X1
SWD: P1 R22 R23
HSE: C26 C28 R24 R25 X2

### Ports
AOCS_SHTDWN (see EPS_Top[2B], EPS_Connectors[2C]), BOOT0 (see EPS_Top[2B], EPS_Connectors[2D]), BOOT0_AOCS (see EPS_Top[2B], EPS_Connectors[2C]), BOOT0_OBC (see EPS_Top[2B], EPS_Connectors[2C]), CS_MCU (see EPS_Top[2B], EPS_Connectors[2C]), I2C1_SCL (see EPS_Top[2C], EPS_Power[4C]), I2C1_SDA (see EPS_Top[2C], EPS_Power[4C]), MCU_SHTDWN (see EPS_Top[2B], EPS_Connectors[2B]), MISO (see EPS_Top[2C], EPS_Connectors[2D]), MOSI (see EPS_Top[2C], EPS_Connectors[2D]), NRST (see EPS_Top[2B], EPS_Connectors[2D]), NRST_AOCS (see EPS_Top[2B], EPS_Connectors[2C]), NRST_COM (see EPS_Top[2B], EPS_Connectors[2C]), NRST_OBC (see EPS_Top[2B], EPS_Connectors[2C]), NRST_PL (see EPS_Top[2B], EPS_Connectors[2C]), Payload_SHTDWN (see EPS_Top[2B], EPS_Connectors[2C]), SCK (see EPS_Top[2B], EPS_Connectors[2C]), T_ALRT1 (see EPS_Top[2C], EPS_Power[4D])

### Nets
+5: P1.10
AGND: C27.1 U8.8(VSSA)
AVDD: C17.2 C19.2 C27.2 FB2.2 U8.9(VDDA)
GND: C17.1 C18.1 C19.1 C20.1 C21.1 C22.1 C23.1 C24.2 C25.2 C26.2 C28.2 C29.2 C30.2 P1.4 P1.9 Q3.2(S) R21.1 R28.1 SW1.1 SW2.2 U8.23(VSS) U8.35(VSS) U8.47(VSS) U10.1(DU) U10.2(E1) U10.3(E2) U10.4(VSS) U10.7(~{WC})
VDD: C18.2 C20.2 C21.2 C22.2 C23.2 C29.1 C30.1 FB2.1 P1.1 R15.2 R16.1 R23.1 R27.1 R33.1 U8.1(VDD) U8.24(VDD) U8.36(VDDIO2) U8.48(VDD) U10.8(VCC)
ALERT: U8.31(PA10) ; port T_ALRT1
AOCS_SHTDWN: U8.18(PB0) ; port AOCS_SHTDWN
BOOT0: R21.2 U8.44(BOOT0) ; port BOOT0
BOOT0_AOCS: U8.25(PB12) ; port BOOT0_AOCS
BOOT0_OBC: U8.27(PB14) ; port BOOT0_OBC
CS_MCU: U8.14(PA4) ; port CS_MCU
LED_BLUE: D8.1(C) U8.16(PA6)
LED_GREEN: Q3.1(G) R28.2 U8.19(PB1)
MCU_SHTDWN: U8.32(PA11) ; port MCU_SHTDWN
MISO: U8.40(PB4) ; port MISO
MOSI: U8.41(PB5) ; port MOSI
NRST: R22.2 R23.2 R33.2 SW2.4 U8.7(NRST) ; port NRST
NRST_AOCS: U8.26(PB13) ; port NRST_AOCS
NRST_COM: U8.29(PA8) ; port NRST_COM
NRST_OBC: U8.28(PB15) ; port NRST_OBC
NRST_PL: U8.30(PA9) ; port NRST_PL
OSC32IN: C24.1 U8.3(PC14-OSC32_IN) X1.1(X1)
OSC32OUT: C25.1 U8.4(PC15-OSC32_OUT) X1.4(X2)
OSC_IN: R24.1 U8.5(PH0-OSC_IN)
OSC_OUT: R25.1 U8.6(PH1-OSC_OUT)
Payload_SHTDWN: U8.15(PA5) ; port Payload_SHTDWN
RX: P1.7 U8.13(PA3)
SCK: U8.39(PB3) ; port SCK
SCL: U8.42(PB6) U10.6(SCL) ; port I2C1_SCL
SDA: U8.43(PB7) U10.5(SDA) ; port I2C1_SDA
SWCLK: P1.3 R19.1
SWDIO: P1.2 R18.1
TX: P1.8 U8.12(PA2)
USER_BUTTON: R15.1 SW1.3 U8.17(PA7)
NetC15_1: C15.1 SW1.4
NetC15_2: C15.2 R17.2
NetC16_1: C16.1 SW2.1
NetC16_2: C16.2 SW2.3
NetC26_1: C26.1 R24.2 X2.2
NetC28_1: C28.1 R25.2 X2.1
NetD7_1: D7.1(C) Q3.3(D)
NetD7_2: D7.2(A) R27.2
NetD8_2: D8.2(A) R16.2
NetP1_6: P1.6 R22.1
NetR17_1: R17.1 SW1.2
NetR18_2: R18.2 U8.34(PA13)
NetR19_2: R19.2 U8.37(PA14)

Not connected (* = marked no-connect by the designer): P1 5 MP1 MP2; U8 2(PC13-ANTI_TAMP) 10(PA0) 11(PA1) 20(PB2) 21(PB10) 22(PB11) 33(PA12) 38(PA15) 45(PB8) 46(PB9); X1 2(NC) 3(NC)

### Library data of the parts
C15-C18 C20-C22 C29 = CMP-2000-05439-1: as C9 on sheet EPS_Power; Case Size/Dimension: 0402; Tolerance (%): ±10%; Manufacturer URL: http://www.samsungsem.com/global/index.jsp; Datasheet URL: https://datasheet.ciiva.com/29198/458718-da-01-en-vs-kondensator-0402-29198423.pdf; Datasheet Version: Nov-10
C19 = CMP-13271-001457-1: as C10 on sheet EPS_Power; Dielectric: X5R; Height: 0.8mm; Capacitance: 1uF; Mount: Surface Mount; Thickness: 0.035inch; Width: 0.031inch; Min Operating Temperature: -55°C; Contact Plating: Tin; Case Code (Imperial): 0603; Depth: 0.8mm; Length: 1.6mm; Max Operating Temperature: 85°C; Packaging: Tape and Reel; Tolerance: 10%; Radiation Hardening: No; Case/Package: 0603; Package Quantity: 1; Voltage Rating: 16V; Case Code (Metric): 1608; Voltage: 16V; Material: Ceramic; Lead Free: Lead Free; Voltage Rating (DC): 16V
C23 = CMP-13271-000015-1: as C1 on sheet EPS_Power; ComponentLink2URL: http://product.samsungsem.com/mlcc/CL21B106KOQNNN.do; Package: 0; Voltage Rating: 16V; Value: 10uF; Height: 1.4mm; Temperature Characteristic: X7R; Category: Cap; Lead Free: Yes; RoHS: TRUE; ComponentLink2Description: Datasheet; Octopart: https://octopart.com/cl21b106koqnnng-samsung-19995691; Device Class L1: Passive Components; Temperature Range Low: -55°C; Device Class L3: Ceramic Capacitors; Ipc Land Pattern Name: CAPC200125X125; Digikey Description: CAP CER 10UF 16V X7R 0805; Automotive: No; Capacitance: 10uF; Temperature Range High: +125°C; Device Class L2: Capacitors; Temperature: -55°C to +125°C
C24 C25 = CMP-2008-04413-1: Part Number: GRM1555C1H6R0DA01D; Manufacturer: Murata
C26 C28 = CMP-06035-011115-1: Ceramic Capacitor for Automotive 20pF ±2% 50VDC C0G 0402 Paper T/R
C27 = CMP-03422-000048-1: CAP CER 0.1UF 16V X7R 0402; Manufacturer: YAGEO; Manufacturer Part Number: CC0402KRX7R7BB104; Material: Ceramic; Automotive Grade: NA; Temperature Coefficient: 30ppm/°C; Tolerance: 0.1; Device Class L1: Passive Components; Temperature Range Low: -55°C; Device Class L3: Ceramic Capacitors; Temperature Characteristic: X7R; Ipc Land Pattern Name: CAPC10050X50; Capacitance: 100 nF; Temperature Range High: +125°C; Voltage Rating: 16 V; Temperature: -55°C to +125°C; RoHS: TRUE; Automotive: No; Height: 0.55mm; Device Class L2: Capacitors; Digikey Description: CAP CER 0.1UF 16V X7R 0402; Package: CC0402; Footprint Url: http://www.yageo.com/exep/pages/download/literatures/UPY-C_GEN_24.pdf; ComponentLink2Description: Datasheet; Category: Cap; Lead Free: Yes; Value: 100 nF; Octopart: https://octopart.com/cc0402krx7r7bb104-yageo-42244624; ComponentLink2URL: http://www.yageo.com/documents/recent/UPY-GP_NP0_16V-to-50V_16.pdf; Mouser Description: 0402 0.1 uF 16 V ±10 % Tolerance X7R SMT Multilayer Ceramic Capacitor
C30 = CMP-13271-000835-1: Cap Ceramic 2.2uF 16V X5R ±10% Pad SMD 0603 +85°C T/R; Case Code (Metric): 1608; Height: 0.8mm; Case/Package: 0603; Depth: 0.8mm; Capacitance: 2.2uF; Voltage Rating: 16V; Case Code (Imperial): 0603; Length: 1.6mm; Packaging: Tape and Reel; Material: Ceramic; Lead Free: Lead Free; Max Operating Temperature: 85°C; Contact Plating: Tin; Thickness: 0.035inch; Radiation Hardening: No; Tolerance: 10%; Min Operating Temperature: -55°C; Voltage: 16V; Dielectric: X5R; Mount: Surface Mount; Package Quantity: 4000; Width: 0.031inch; Voltage Rating (DC): 16V
D7 = CMP-57192-000001-1: LED GREEN CLEAR SMD; Forward Voltage: 2.2V; Test Current: 20mA; Luminous Intensity: 45mcd; Lens Style: Diffused; Number of LEDs: 1; Approvals: UL; Lens Color: Colorless; Dominant Wavelength: 574nm; Viewing Angle: 120°; Lead Free: Lead Free; Case/Package: 0402; Number of Pins: 2; Width: 0.5mm; Min Operating Temperature: -40°C; Case Code (Imperial): 0402; Packaging: Tape and Reel; Color: Green; Max Operating Temperature: 85°C; Case Code (Metric): 1005; Mount: Surface Mount; Length: 1mm; Wavelength: 574nm; Height: 0.5mm; Illumination Color: Green; Lens Transparency: Clear; Package Quantity: 1; Forward Current: 20mA
D8 = CMP-08952-000025-1: LED BLUE CLEAR 1006 SMD; Manufacturer: Rohm; Led Orientation: Top View; Reverse Voltage: 5V; Wavelength: 470nm; Luminous Intensity: 17mcd; Power Dissipation: 66mW; Forward Voltage: 2.9V; Forward Current: 5mA; ComponentLink2URL: https://media.digikey.com/pdf/Data%20Sheets/Rohm%20PDFs/SML-P1_Series_RevB.pdf; ComponentLink2Description: Datasheet; Colour: Blue; RoHS: TRUE; Package: SML-P12; Device Class L1: Optoelectronics; Manufacturer Part Number: SMLP12BC7TT86; Automotive: No; Temperature Range Low: -40°C; Temperature: -40°C to +85°C; Height: 0.25mm; Octopart: https://octopart.com/smlp12bc7tt86-rohm-9290887; Digikey Description: LED BLUE CLEAR 1006 SMD; Lead Free: Yes; Device Class L2: LEDs; Category: Diode; Device Class L3: unset; Mouser Description: ROHM SMLP12BC7TT86, SML-P12 PICOLED Series Blue LED, 1006(0402), Rectangle Lens; Temperature Range High: +85°C
FB2 = CMP-03913-52738347-1: 74279221601 Ferrite Beads Multi-Layer High Current 600Ohm 25% 100MHz 2.5A 0.05Ohm DCR 1206 Automotive T/R; Resistance: 600Ω; DC Resistance (DCR): 38mΩ; Number of Lines: 1; Packaging: Digi-Reel®; Max Operating Temperature: 125°C; Case/Package: 1206; Height: 1.1mm; Tolerance: 25%; Weight: 10.007382mg; NexarPartId: 52738347; Current Rating: 2.5A; Case Code (Metric): 3216; Case Code (Imperial): 1206; Termination: SMD/SMT; Test Frequency: 100MHz; Length: 3.2mm; Width: 1.6mm; Max DC Current: 2.5A; Min Operating Temperature: -55°C; Max Current Rating: 2.5A; Impedance: 600Ω; REACH SVHC: Unknown; Mount: Surface Mount; RoHS: Compliant
P1 = CMP-2000-07083-1: Male Header, Pitch 1 mm, 1 x 10 Position, Height 1.8 mm, -25 to 85 degC; Manufacturer: JST; Datasheet URL: http://www.jst-mfg.com/product/pdf/eng/eSHL.pdf; Mounting Technology: SurfaceMount; Package Reference: SM10B-SHLS-TF; Manufacturer URL: http://www.jst.com/home2.html; Package Description: Male Header, Pitch 1 mm, 1 x 10 Position, Height 1.8 mm; Datasheet Version: 04/2015
Q3 = CMP-14409-000038-1: MOSFET N-CH 60V 265MA TO236AB
R15 = CMP-2002-01154-4: as R13 on sheet EPS_Power; Height: 0.35 mm; Mounting Technology: Surface Mount; REACH SVHC: Yes; Resistance: 4.7 KOhm; Max Operating Temperature: 155 degC; ComponentLink1Description: Manufacturer URL; ComponentLink2Description: Datasheet; Pins: 2; PackageReference: 0402; Tolerance: 1%; Case Code (Imperial): 0402; Length: 1 mm; PackageDescription: 2-Pin Surface Mount Device, Body 1 x 0.5 mm; RoHSCompliant: true; Package Quantity: 1; Radiation Hardening: No; DatasheetVersion: 04/2015; Width: 0.5 mm; Case Code (Metric): 1005; Mount: Surface Mount; ComponentLink1URL: http://www.panasonic.com/; Min Operating Temperature: -55 degC; Packaging: Cut Tape; ComponentLink2URL: http://industrial.panasonic.com/cdbs/www-data/pdf/RDA0000/AOA0000C86.pdf
R16 R27 = CMP-2002-00166-1: Manufacturer: Vishay Dale; Part Number: CRCW0402680RFKED
R17 = CMP-2000-00179-1: Manufacturer: Panasonic; Part Number: ERJ-3EKF1000V
R18 R19 R22 = CMP-1659-00033-1: as R20 on sheet EPS_Connectors; ComponentLink2URL: http://www.yageo.com/documents/recent/PYu-RC_Group_51_RoHS_L_04.pdf; RoHSCompliant: true; Max Operating Temperature: 100 degC; PackageDescription: 2-Pin Surface Mount Device, Body 1.6 x 0.8 mm; ComponentLink1Description: Manufacturer URL; ComponentLink1URL: http://www.yageo.com/; Length: 18.5 mm; REACH SVHC: Unknown; Pins: 4; DatasheetVersion: Rev. 4, 02/2016; PackageReference: 0603; Output Current: 8 A; Min Operating Temperature: -25 degC; Height: 19.6 mm; Mount: Through Hole; Radiation Hardening: No; ComponentLink2Description: Datasheet; Package Quantity: 200; Packaging: Rail/Tube
R21 R23 R33 = CMP-2002-07353-1: as R12 on sheet EPS_Power
R24 R25 = CMP-2000-03228-1: Part Number: CRCW060330R0FKEA; Manufacturer: Vishay Dale
R28 = CMP-08839-019445-1: Thick Film Chip Resistor, 0402, 1MΩ, 1%, 100ppm/°C, 0.063W, 50V; Max Power Dissipation: 63mW; Resistance: 1MR; Lead Free: Lead Free; Case Code (Imperial): 0402; Max Operating Temperature: 155°C; Package Quantity: 1; Length: 0.039inch; Temperature Coefficient: 100ppm/°C; Case Code (Metric): 1005; Tolerance: 1%; Case/Package: 0402; RoHS Compliant: Yes; Number of Terminations: 2; Resistor Type: Thick Film; Height: 0.016inch; Packaging: Tape and Reel; Min Operating Temperature: -55°C; Voltage Rating (DC): 50V; Width: 0.02inch; Series: MCR
SW1 SW2 = CMP-10040-000001-2: SWITCH TACTILE SPST-NO 0.05A 16V; Throw Configuration: SPST; Operating Force: 160gf; Actuator Type: Standard; Switch Travel: 0.15mm; Switch Function: Off-Mom; Max Current Rating: 50mA; Mechanical Life: 150000Cycles; Illumination Type: Non-Illuminated; Package Quantity: 2900; Depth: 4.6mm; Mount: Surface Mount; Packaging: Tape and Reel; Length: 3.2mm; RoHS Compliant: Yes; Case/Package: SMD/SMT; Voltage Rating (DC): 16V; Min Operating Temperature: -40°C; Termination: J-Bend; Lead Free: Lead Free; Contact Plating: Silver; Orientation: Straight; Max Operating Temperature: 85°C; Current Rating: 50mA; Color: Black
U8 = CMP-1546-00003-1: Ultra-Low-Power ARM Cortex-M0+ MCU, 64 KB Flash, 1.8 to 3.6 V, -40 to 85 degC, 48-Pin LQFP, RoHS, Tray; RAM: 8 KB; Flash: 64 KB; Data EEPROM: 2 KB; VDD Max: 3.6 V; VDD Min: 1.8 V; PartNumber: STM32L051C8T6; ComponentLink3URL: http://www.st.com/st-web-ui/static/active/en/resource/technical/document/datasheet/DM00058181.pdf; ComponentLink1URL: http://www.st.com/web/en/home.html; Temperature Min: -40 degC; DatasheetVersion: Rev. 4; ComponentLink3Description: Package Specification; Mounting Technology: Surface Mount; ComponentLink1Description: Manufacturer URL; Packing: Tray; Temperature Max: 85 degC; ComponentLink2URL: http://www.st.com/st-web-ui/static/active/en/resource/technical/document/datasheet/DM00108219.pdf; PackageDescription: 48-Pin Frame Chip Scale Package, Body 7 x 7 mm, Pitch 0.5 mm; ComponentLink2Description: Datasheet; RoHS: TRUE
U10 = CMP-12142-000012-1: IC EEPROM 1M I2C 1MHZ 8TSSOP; Manufacturer: STMicroelectronics; Memory Size: 1Mbits; Min Supply Voltage: 1.8V; Access Time: 500ns; Nominal Supply Current: 1-2mA; Max Supply Voltage: 5.5V; Standoff Height: 0.05mm; Package: TSSOP8-TSSOP8AM; Digikey Description: IC EEPROM 1M I2C 1MHZ 8TSSOP; Mouser Description: EEPROM 1-Mbit I2C EEProm 256kB 1.7V to 5.5V; Device Class L3: EEPROM; Temperature Range High: +85°C; Lead Free: Yes; Frequency: 1MHz; Octopart: https://octopart.com/m24m01-rdw6tp-stmicroelectronics-55567287; Temperature: -40°C to +85°C; Memory Type: EEPROM; RoHS: TRUE; Ambient Temperature Range Low: -40°C; Ambient Temperature Range High: +85°C; Height: 1.2mm; Ipc Land Pattern Name: SOP65P300X120-8; Category: IC; ComponentLink2Description: Datasheet; Temperature Range Low: -40°C; Manufacturer Part Number: M24M01-RDW6TP; Device Class L1: Integrated Circuits (ICs); Device Class L2: Memory; Automotive: No; ComponentLink2URL: https://www.st.com/resource/en/datasheet/m24m01-r.pdf; Interface: I2C
X1 = CMP-2000-05036-1: Low Frequency Crystal, 32.768 KHz, 6 pF, +/- 20 ppm, -40 to 85 degC, 4-Pin SMD, RoHS, Tape and Reel; Manufacturer: Abracon; Tolerance: 20PPM; ESR: 50kOhms; Case Width: 3.8mm; Case Height: 2.5mm; Case Length: 8mm; Load Capacitance: 6pF; Operating Temperature Range: -40Cto+85C; Package Reference: ABS25; Factory Pack Quantity: 3000; Package Description: 4-Pin Surface Mount Device, Body 8 x 3.8 mm, Pitch 5.5 mm; Frequency: 32.768kHz; Termination Style: SMD/SMT; Manufacturer URL: http://www.abracon.com/; Type: LowFrequencyCrystal; Dimensions: 3.8mmWx8mmLx2.5mmH; Product Category: Crystals; Series: ABS25; RoHS: Details; Package / Case: 8mmx3.8mm; Datasheet Version: Jun-17; Brand: ABRACON; Datasheet URL: https://datasheet.ciiva.com/854/abs25-854528.pdf; Packaging: Reel; Mounting Style: SMD/SMT
X2 = CMP-2000-05033-2: Crystal 8MHz ±20ppm 18pF SMD-2 5mm x 3.2mm; Series Resistance: 500R; Frequency Stability: 30ppm; ESR (Equivalent Series Resistance): 140R; Load Capacitance: 18pF; Height: 0.051inch; Tolerance: 20ppm; Depth: 3.2mm; Max Operating Temperature: 85°C; Frequency: 8MHz; Termination: SMD/SMT; Lead Free: Lead Free; Number of Pins: 2; Width: 3.2mm; RoHS Compliant: Yes; Resistor Type: Ceramic; Length: 5mm; Mount: Surface Mount; Case/Package: CSMD; Package Quantity: 1000; Radiation Hardening: No; Min Operating Temperature: -40°C; Packaging: Tape and Reel; Frequency Tolerance: 20ppm

## Nets that join several sheets
+5: EPS_Power (6 pins), EPS_MCU (P1.10)
AGND: EPS_Connectors (J3.32), EPS_MCU (C27.1 U8.8)
AVDD: EPS_Connectors (J3.7), EPS_MCU (5 pins)
BAT_BUS: EPS_Power (6 pins), EPS_Connectors (J2.6 J2.24 J2.26)
GND: EPS_Power (37 pins), EPS_Connectors (6 pins), EPS_MCU (28 pins)
VDD: EPS_Power (14 pins), EPS_Connectors (J2.10 J2.44 R36.2), EPS_MCU (19 pins)
ALERT: EPS_Power (R32.2 U5.3 U6.3 U7.3), EPS_MCU (U8.31)
AOCS_SHTDWN: EPS_Connectors (J3.10), EPS_MCU (U8.18)
BOOT0: EPS_Connectors (J3.14), EPS_MCU (R21.2 U8.44)
BOOT0_AOCS: EPS_Connectors (J2.9), EPS_MCU (U8.25)
BOOT0_OBC: EPS_Connectors (J2.7), EPS_MCU (U8.27)
CS_MCU: EPS_Connectors (J3.6 R36.1), EPS_MCU (U8.14)
MCU_SHTDWN: EPS_Connectors (J2.18), EPS_MCU (U8.32)
MISO: EPS_Connectors (R20.1), EPS_MCU (U8.40)
MOSI: EPS_Connectors (J3.29), EPS_MCU (U8.41)
NRST: EPS_Connectors (J3.12), EPS_MCU (5 pins)
NRST_AOCS: EPS_Connectors (J2.16), EPS_MCU (U8.26)
NRST_COM: EPS_Connectors (J2.40), EPS_MCU (U8.29)
NRST_OBC: EPS_Connectors (J2.14), EPS_MCU (U8.28)
NRST_PL: EPS_Connectors (J2.42), EPS_MCU (U8.30)
Payload_SHTDWN: EPS_Connectors (J3.8), EPS_MCU (U8.15)
SCK: EPS_Connectors (J3.31), EPS_MCU (U8.39)
SCL: EPS_Power (5 pins), EPS_MCU (U8.42 U10.6)
SDA: EPS_Power (5 pins), EPS_MCU (U8.43 U10.5)